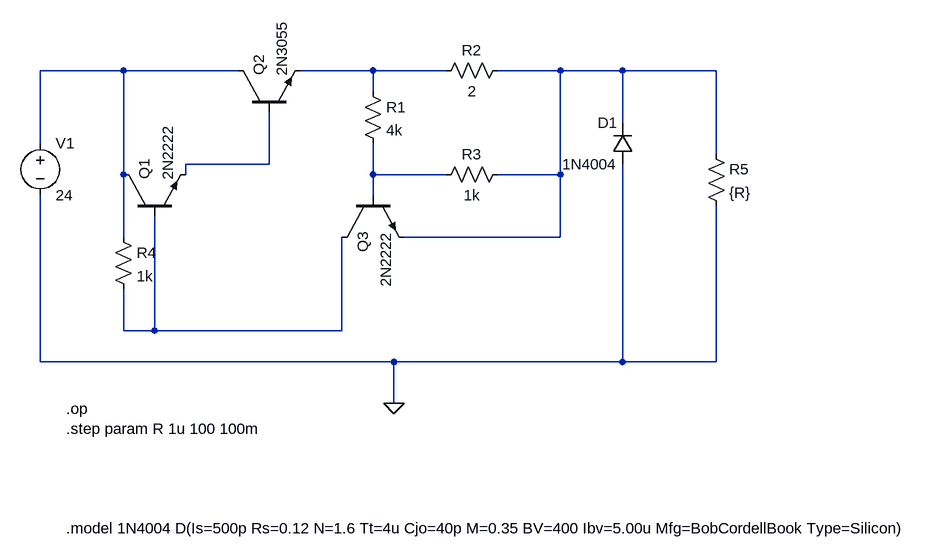
[diagram p0: schematic Solar Emulator 2.asc]
Solar Emulator 2.asc, the LTspice schematic file:
Version 4
SHEET 1 1492 864
WIRE 256 144 128 144
WIRE 432 144 256 144
WIRE 640 144 528 144
WIRE 752 144 640 144
WIRE 928 144 832 144
WIRE 1024 144 928 144
WIRE 1168 144 1024 144
WIRE 640 176 640 144
WIRE 1024 224 1024 144
WIRE 128 256 128 144
WIRE 1168 272 1168 144
WIRE 480 288 480 208
WIRE 480 288 352 288
WIRE 256 304 256 144
WIRE 352 304 352 288
WIRE 640 304 640 256
WIRE 752 304 640 304
WIRE 928 304 928 144
WIRE 928 304 832 304
WIRE 640 336 640 304
WIRE 256 400 256 304
WIRE 928 400 928 304
WIRE 928 400 688 400
WIRE 256 544 256 480
WIRE 304 544 304 368
WIRE 304 544 256 544
WIRE 592 544 592 400
WIRE 592 544 304 544
WIRE 128 592 128 336
WIRE 672 592 128 592
WIRE 1024 592 1024 288
WIRE 1024 592 672 592
WIRE 1168 592 1168 352
WIRE 1168 592 1024 592
WIRE 672 656 672 592
FLAG 672 656 0
SYMBOL voltage 128 240 R0
SYMATTR InstName V1
SYMATTR Value 24
SYMBOL npn 256 368 R270
SYMATTR InstName Q1
SYMATTR Value 2N2222
SYMBOL npn 432 208 R270
SYMATTR InstName Q2
SYMATTR Value 2N3055
SYMBOL Res 624 160 R0
SYMATTR InstName R1
SYMATTR Value 4k
SYMBOL Res 848 128 R90
WINDOW 0 0 56 VBottom 2
WINDOW 3 32 56 VTop 2
SYMATTR InstName R2
SYMATTR Value 2
SYMBOL Res 848 288 R90
WINDOW 0 0 56 VBottom 2
WINDOW 3 32 56 VTop 2
SYMATTR InstName R3
SYMATTR Value 1k
SYMBOL npn 592 336 M90
SYMATTR InstName Q3
SYMATTR Value 2N2222
SYMBOL Res 240 384 R0
SYMATTR InstName R4
SYMATTR Value 1k
SYMBOL diode 1040 288 R180
WINDOW 0 24 64 Left 2
WINDOW 3 24 0 Left 2
SYMATTR InstName D1
SYMATTR Value 1N4004
SYMATTR SpiceModel 1N4004
SYMBOL Res 1152 256 R0
SYMATTR InstName R5
SYMATTR Value {R}
TEXT 168 664 Left 2 !.op\n.step param R 1u 100 100m
TEXT 168 848 Left 2 !.model 1N4004 D(Is=500p Rs=0.12 N=1.6 Tt=4u Cjo=40p M=0.35 BV=400 Ibv=5.00u Mfg=BobCordellBook Type=Silicon)

The netlist it stands for:
* Solar Emulator 2.asc
V1 N001 0 24
Q1 N001 N006 N004 0 2N2222
Q2 N001 N004 N002 0 2N3055
R1 N002 N005 4k
R2 N003 N002 2
R3 N003 N005 1k
Q3 N006 N005 N003 0 2N2222
R4 N001 N006 1k
D1 0 N003 1N4004 1N4004
R5 N003 0 {R}
.model D D
.lib standard.dio
.model NPN NPN
.model PNP PNP
.lib standard.bjt
.op
.step param R 1u 100 100m
.model 1N4004 D(Is=500p Rs=0.12 N=1.6 Tt=4u Cjo=40p M=0.35 BV=400 Ibv=5.00u Mfg=BobCordellBook Type=Silicon)
.backanno
.end